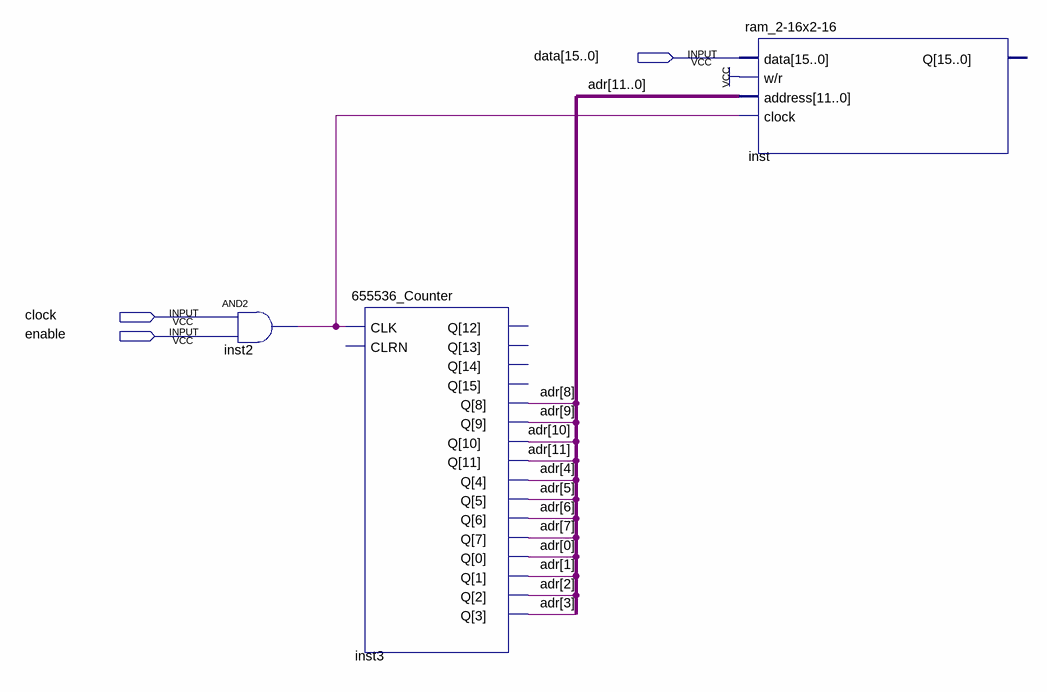
[diagram p0: schematic sheet]
// Quartus schematic stack_2-12x2-16.bdf as structural Verilog: 3 symbols, 3 pins
module \stack_2-12x2-16  (
  input  [15:0] data,
  input  clock,
  input  enable
);

  wire inst2_out;
  wire [11:0] adr;
  wire [15:0] inst3_q_open;  // unused outputs

  and inst2 (inst2_out, clock, enable);
  \655536_Counter  inst3 (.CLK(inst2_out), .Q({inst3_q_open[15:12], adr}));  // open: CLRN
  \ram_2-16x2-16  inst (.data(data), .\w/r (1'b1), .address(adr), .clock(inst2_out));  // open: Q
endmodule
